# EAGLE schematic Hydra OSD (EAGLE 9.0.1)
CNAME: Hydrometra; CREVISION: 1.0; DESIGNER: Sergio Betancur M.
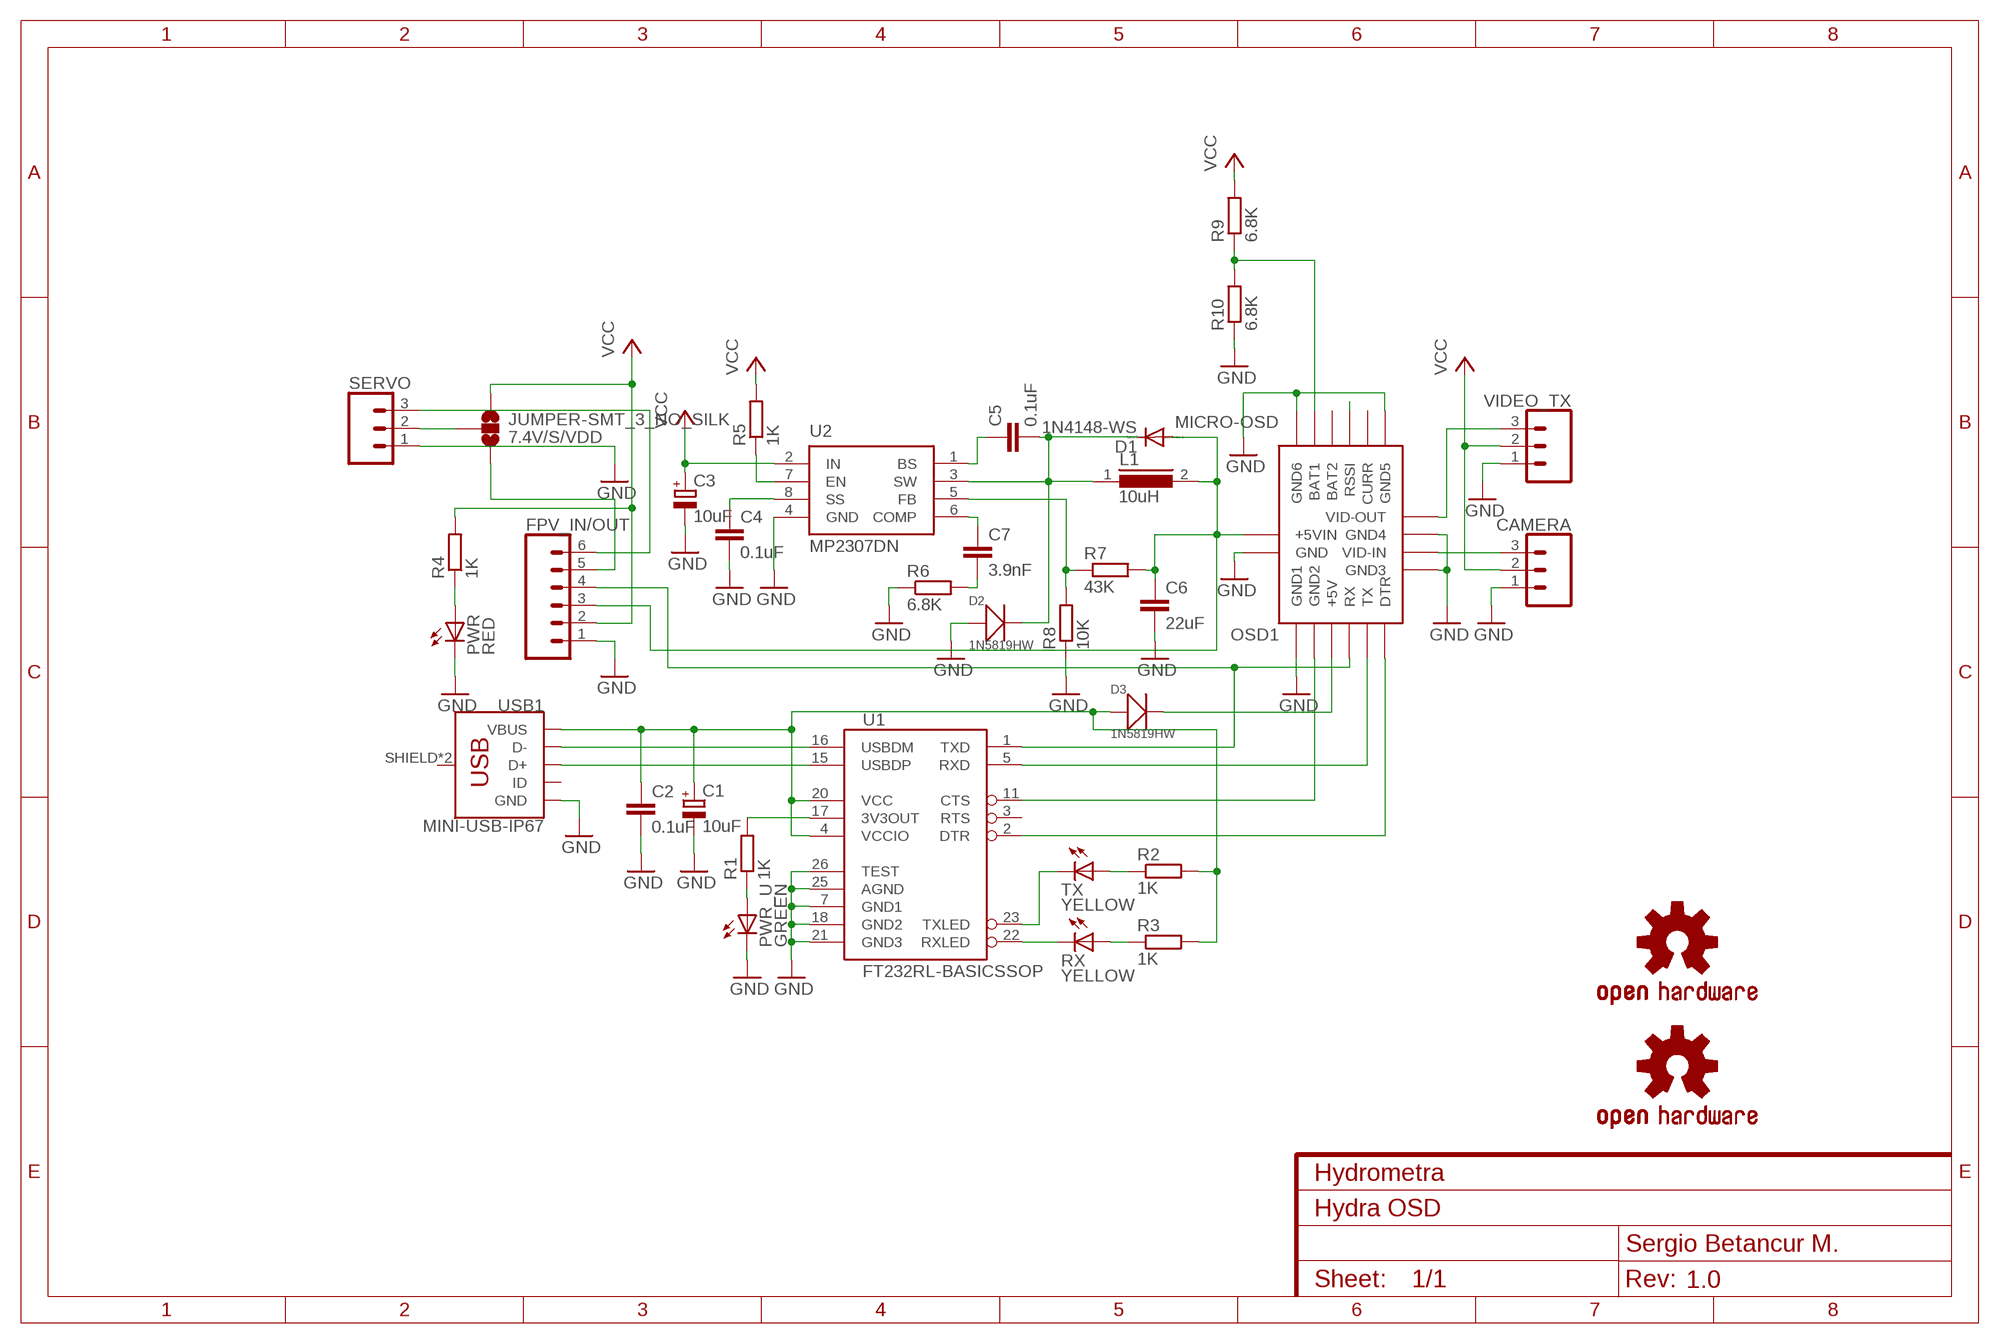
[diagram p0: schematic, sheet 1]

## Parts
7.4V/S/VDD  JUMPER-SMT_3_NO_SILK  [SMT-JUMPER_3_NO_SILK]
C1  10uF  CPOL-EUCT3216  [CT3216]
C2  0.1uF  C-EUC0603  [C0603]
C3  10uF  CPOL-EUCT3216  [CT3216]
C4  0.1uF  C-EUC0603  [C0603]
C5  0.1uF  C-EUC0603  [C0603]
C6  22uF  C-EUC0805  [C0805]
C7  3.9nF  C-EUC0603  [C0603]
CAMERA  CONN_03POLAR  [MOLEX-1X3]
D1  1N4148-WS  DIODE-SOD323-W  [SOD323-W]
D2  1N5819HW  SMD-DIODE-SCHOTTKY-40V-500MA(SOD-123)  [SOD-123]
D3  1N5819HW  SMD-DIODE-SCHOTTKY-40V-500MA(SOD-123)  [SOD-123]
FPV_IN/OUT  CONN_06POLAR  [MOLEX-1X6]
L1  10uH  DR73  [DR73]
LOGO1  OSHW-LOGOL  [OSHW-LOGO-L]
LOGO2  OSHW-LOGOL  [OSHW-LOGO-L]
OSD1  MICRO-OSD  [MICRO-OSD]
PWR  RED  LEDCHIPLED_0603  [CHIPLED_0603]
PWR_U  GREEN  LEDCHIPLED_0603  [CHIPLED_0603]
R1  1K  R-EU_R0603  [R0603]
R2  1K  R-EU_R0603  [R0603]
R3  1K  R-EU_R0603  [R0603]
R4  1K  R-EU_R0603  [R0603]
R5  1K  R-EU_R0603  [R0603]
R6  6.8K  R-EU_R0603  [R0603]
R7  43K  R-EU_R0603  [R0603]
R8  10K  R-EU_R0603  [R0603]
R9  6.8K  R-EU_R0603  [R0603]
R10  6.8K  R-EU_R0603  [R0603]
RX  YELLOW  LEDCHIPLED_0603  [CHIPLED_0603]
SERVO  CONN_03POLAR  [MOLEX-1X3]
TX  YELLOW  LEDCHIPLED_0603  [CHIPLED_0603]
U1  FT232RL-BASICSSOP  [SSOP28DB]
U2  MP2307DN  [SOIC8]
USB1  MINI-USB-IP67  [IP67-MINI-USB]
VIDEO_TX  CONN_03POLAR  [MOLEX-1X3]

## Nets
5V: D3.- OSD1.4(+5V)
+3.3V: R1.2 U1.17(3V3OUT)
+5V_USB: C1.+ C2.1 D3.+ R2.2 R3.2 U1.4(VCCIO) U1.20(VCC) USB1.1(VBUS)
+5VIN: C6.1 D1.A FPV_IN/OUT.3 L1.2 OSD1.8(+5VIN) R7.2
+7.4IN: 7.4V/S/VDD.1 FPV_IN/OUT.5
BS: C5.1 U2.1(BS)
COMP: C7.1 U2.6(COMP)
CTS: OSD1.5(GND2) U1.11(CTS)
D+: U1.15(USBDP) USB1.3(D+)
D-: U1.16(USBDM) USB1.2(D-)
DTR: OSD1.1(DTR) U1.2(DTR)
EN: R5.1 U2.7(EN)
FB: R7.1 R8.2 U2.5(FB)
GND: C1.- C2.2 C3.- C4.2 C6.2 CAMERA.1 D2.+ FPV_IN/OUT.1 OSD1.6(GND1) OSD1.7(GND) OSD1.9(GND6) OSD1.14(GND5) OSD1.16(GND4) OSD1.18(GND3) PWR.C PWR_U.C R6.1 R8.1 R10.1 SERVO.1 U1.7(GND1) U1.18(GND2) U1.21(GND3) U1.25(AGND) U1.26(TEST) U2.4(GND) USB1.5(GND) VIDEO_TX.1
N$1: PWR.A R4.1
N$2: PWR_U.A R1.1
N$3: R2.1 TX.A
N$4: R3.1 RX.A
N$5: 7.4V/S/VDD.2 SERVO.2
N$6: C7.2 R6.2
N$7: OSD1.10(BAT1) R9.1 R10.2
N$15: OSD1.12(RSSI)
PWM: FPV_IN/OUT.6 SERVO.3
RX: FPV_IN/OUT.4 OSD1.3(RX) U1.1(TXD)
RXLED: RX.C U1.22(RXLED)
SS: C4.1 U2.8(SS)
SW: C5.2 D1.C D2.- L1.1 U2.3(SW)
TX: OSD1.2(TX) U1.5(RXD)
TXLED: TX.C U1.23(TXLED)
VCC: 7.4V/S/VDD.3 C3.+ CAMERA.2 FPV_IN/OUT.2 R4.2 R5.2 R9.2 U2.2(IN) VIDEO_TX.2
VID-IN: CAMERA.3 OSD1.17(VID-IN)
VID-OUT: OSD1.15(VID-OUT) VIDEO_TX.3
Unconnected: OSD1.11(BAT2) OSD1.13(CURR) U1.3(RTS) USB1.4(ID) USB1.SHIELD USB1.SHIELD2(SHIELD)

## Library data of the parts
7.4V/S/VDD = SparkFun-Jumpers:JUMPER-SMT_3_NO: Normally open jumper This jumper has three pads in close proximity to each other. Apply solder to close the connection(s).
C1 C3 = rcl:CPOL-EU: POLARIZED CAPACITOR, European symbol; SPICEPREFIX: C
C2 C4-C7 = rcl:C-EU: CAPACITOR, European symbol; SPICEPREFIX: C
CAMERA SERVO VIDEO_TX = SparkFun-Connectors:CONN_03: Multi connection point. Often used as Generic Header-pin footprint for 0.1 inch spaced/style header connections On any of the 0.1 inch spaced packages, you can populate with these: Break Away Headers - Straight <https://www.sparkfun.com/products/116> (PRT-00116) Break Away Male Headers - Right Angle <https://www.sparkfun.com/products/553> (PRT-00553) Female Headers <https://www.sparkfun.com/products/115> (PRT-00115) Break Away Headers - Machine Pin <https://www.sparkfun.com/products/117> (PRT-00117) Break Away Female Headers - Swiss Machine Pin <https://www.sparkfun.com/products/743> (PRT-00743) Stackable Header - 3 Pin (Female, 0.1") <https://www.sparkfun.com/products/13875> (PRT-13875) For SCREWTERMINALS and SPRING TERMINALS visit here: Screw Terimnals on SparkFun.com <https://www.sparkfun.com/search/results?term=Screw+Terminals> (5mm/3.5mm/2.54mm spacing) This device is also useful as a general connection point to wire up your design to another part of your project. Our various solder wires solder well into these plated through hole pads. Hook-Up Wire - Assortment (Stranded, 22 AWG) <https://www.sparkfun.com/products/11375> (PRT-11375) Hook-Up Wire - Assortment (Solid Core, 22 AWG) <https://www.sparkfun.com/products/11367> (PRT-11367) View the entire wire category on our website here <https://www.sparkfun.com/categories/141> Special notes: Molex polarized connector foot print use with SKU : PRT-08232 with associated crimp pins and housings.; PROD_ID: CONN-08625; SF_ID: PRT-08096
D1 = diode:DIODE-: DIODE
D2 D3 = Seeed-Diode:SMD-DIODE-SCHOTTKY-40V-500MA(SOD-123): 304020012; MPN: B0540W; VALUE: 40V-500MA
FPV_IN/OUT = SparkFun-Connectors:CONN_06: Multi connection point. Often used as Generic Header-pin footprint for 0.1 inch spaced/style header connections On any of the 0.1 inch spaced packages, you can populate with these: Break Away Headers - Straight <https://www.sparkfun.com/products/116> (PRT-00116) Break Away Male Headers - Right Angle <https://www.sparkfun.com/products/553> (PRT-00553) Female Headers <https://www.sparkfun.com/products/115> (PRT-00115) Break Away Headers - Machine Pin <https://www.sparkfun.com/products/117> (PRT-00117) Break Away Female Headers - Swiss Machine Pin <https://www.sparkfun.com/products/743> (PRT-00743) Arduino Stackable Header - 6 Pin <https://www.sparkfun.com/products/9280> (PRT-09280) For SCREWTERMINALS and SPRING TERMINALS visit here: Screw Terimnals on SparkFun.com <https://www.sparkfun.com/search/results?term=Screw+Terminals> (5mm/3.5mm/2.54mm spacing) This device is also useful as a general connection point to wire up your design to another part of your project. Our various solder wires solder well into these plated through hole pads. Hook-Up Wire - Assortment (Stranded, 22 AWG) <https://www.sparkfun.com/products/11375> (PRT-11375) Hook-Up Wire - Assortment (Solid Core, 22 AWG) <https://www.sparkfun.com/products/11367> (PRT-11367) View the entire wire category on our website here <https://www.sparkfun.com/categories/141>
L1 = inductors:DR73: High Power Density, High Efficiency, Shielded Inductors Source: coiltronics_dr_series.pdf; SPICEPREFIX: L
LOGO1 LOGO2 = SparkFun-Aesthetics:OSHW-LOGO: Open-Source Hardware (OSHW) Logo This logo indicates the piece of hardware it is found on incorporates a OSHW license and/or adheres to the definition of open source hardware found here: http://freedomdefined.org/OSHW
OSD1 = All-IN:MICRO-OSD
PWR RX TX = led:LED: LED OSRAM: - CHIPLED LG R971, LG N971, LY N971, LG Q971, LY Q971, LO R971, LY R971 LH N974, LH R974 LS Q976, LO Q976, LY Q976 LO Q996 - Hyper CHIPLED LW Q18S LB Q993, LB Q99A, LB R99A - SideLED LS A670, LO A670, LY A670, LG A670, LP A670 LB A673, LV A673, LT A673, LW A673 LH A674 LY A675 LS A676, LA A676, LO A676, LY A676, LW A676 LS A679, LY A679, LG A679 - Hyper Micro SIDELED® LS Y876, LA Y876, LO Y876, LY Y876 LT Y87S - SmartLED LW L88C, LW L88S LB L89C, LB L89S, LG L890 LS L89K, LO L89K, LY L89K LS L896, LA L896, LO L896, LY L896 - TOPLED LS T670, LO T670, LY T670, LG T670, LP T670 LSG T670, LSP T670, LSY T670, LOP T670, LYG T670 LG T671, LOG T671, LSG T671 LB T673, LV T673, LT T673, LW T673 LH T674 LS T676, LA T676, LO T676, LY T676, LB T676, LH T676, LSB T676, LW T676 LB T67C, LV T67C, LT T67C, LS T67K, LO T67K, LY T67K, LW E67C LS E67B, LA E67B, LO E67B, LY E67B, LB E67C, LV E67C, LT E67C LW T67C LS T679, LY T679, LG T679 LS T770, LO T770, LY T770, LG T770, LP T770 LB T773, LV T773, LT T773, LW T773 LH T774 LS E675, LA E675, LY E675, LS T675 LS T776, LA T776, LO T776, LY T776, LB T776 LHGB T686 LT T68C, LB T68C - Hyper Mini TOPLED® LB M676 - Mini TOPLED Santana® LG M470 LS M47K, LO M47K, LY M47K Source: http://www.osram.convergy.de LUXEON: - LUMILED® LXK2-PW12-R00, LXK2-PW12-S00, LXK2-PW14-U00, LXK2-PW14-V00 LXK2-PM12-R00, LXK2-PM12-S00, LXK2-PM14-U00 LXK2-PE12-Q00, LXK2-PE12-R00, LXK2-PE12-S00, LXK2-PE14-T00, LXK2-PE14-U00 LXK2-PB12-K00, LXK2-PB12-L00, LXK2-PB12-M00, LXK2-PB14-N00, LXK2-PB14-P00, LXK2-PB14-Q00 LXK2-PR12-L00, LXK2-PR12-M00, LXK2-PR14-Q00, LXK2-PR14-R00 LXK2-PD12-Q00, LXK2-PD12-R00, LXK2-PD12-S00 LXK2-PH12-R00, LXK2-PH12-S00 LXK2-PL12-P00, LXK2-PL12-Q00, LXK2-PL12-R00 Source: www.luxeon.com KINGBRIGHT: KA-3528ASYC Source: www.kingbright.com
PWR_U = led:LED: LED OSRAM: - CHIPLED LG R971, LG N971, LY N971, LG Q971, LY Q971, LO R971, LY R971 LH N974, LH R974 LS Q976, LO Q976, LY Q976 LO Q996 - Hyper CHIPLED LW Q18S LB Q993, LB Q99A, LB R99A - SideLED LS A670, LO A670, LY A670, LG A670, LP A670 LB A673, LV A673, LT A673, LW A673 LH A674 LY A675 LS A676, LA A676, LO A676, LY A676, LW A676 LS A679, LY A679, LG A679 - Hyper Micro SIDELED® LS Y876, LA Y876, LO Y876, LY Y876 LT Y87S - SmartLED LW L88C, LW L88S LB L89C, LB L89S, LG L890 LS L89K, LO L89K, LY L89K LS L896, LA L896, LO L896, LY L896 - TOPLED LS T670, LO T670, LY T670, LG T670, LP T670 LSG T670, LSP T670, LSY T670, LOP T670, LYG T670 LG T671, LOG T671, LSG T671 LB T673, LV T673, LT T673, LW T673 LH T674 LS T676, LA T676, LO T676, LY T676, LB T676, LH T676, LSB T676, LW T676 LB T67C, LV T67C, LT T67C, LS T67K, LO T67K, LY T67K, LW E67C LS E67B, LA E67B, LO E67B, LY E67B, LB E67C, LV E67C, LT E67C LW T67C LS T679, LY T679, LG T679 LS T770, LO T770, LY T770, LG T770, LP T770 LB T773, LV T773, LT T773, LW T773 LH T774 LS E675, LA E675, LY E675, LS T675 LS T776, LA T776, LO T776, LY T776, LB T776 LHGB T686 LT T68C, LB T68C - Hyper Mini TOPLED® LB M676 - Mini TOPLED Santana® LG M470 LS M47K, LO M47K, LY M47K Source: http://www.osram.convergy.de LUXEON: - LUMILED® LXK2-PW12-R00, LXK2-PW12-S00, LXK2-PW14-U00, LXK2-PW14-V00 LXK2-PM12-R00, LXK2-PM12-S00, LXK2-PM14-U00 LXK2-PE12-Q00, LXK2-PE12-R00, LXK2-PE12-S00, LXK2-PE14-T00, LXK2-PE14-U00 LXK2-PB12-K00, LXK2-PB12-L00, LXK2-PB12-M00, LXK2-PB14-N00, LXK2-PB14-P00, LXK2-PB14-Q00 LXK2-PR12-L00, LXK2-PR12-M00, LXK2-PR14-Q00, LXK2-PR14-R00 LXK2-PD12-Q00, LXK2-PD12-R00, LXK2-PD12-S00 LXK2-PH12-R00, LXK2-PH12-S00 LXK2-PL12-P00, LXK2-PL12-Q00, LXK2-PL12-R00 Source: www.luxeon.com KINGBRIGHT: KA-3528ASYC Source: www.kingbright.com; SPICEPREFIX: B
R1-R10 = rcl:R-EU_: RESISTOR, European symbol; SPICEPREFIX: R
U1 = SparkFun:FT232RL-BASIC: USB UART This is the simplified version of the FT232RL unit. Only what you need, nothing you don't. Spark Fun Electronics SKU : COM-00650
U2 = All-IN:MP2307DN
USB1 = Hydra 2018:MINI-USB-IP67